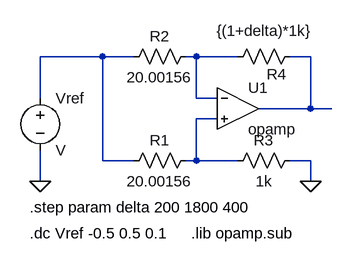
[diagram p0: schematic schema 2.3 Luca Fantin 2000156.asc]
schema 2.3 Luca Fantin 2000156.asc, the LTspice schematic file:
Version 4
SHEET 1 880 680
WIRE 96 0 0 0
WIRE 144 0 96 0
WIRE 240 0 224 0
WIRE 304 0 240 0
WIRE 416 0 384 0
WIRE 0 64 0 0
WIRE 240 64 240 0
WIRE 272 64 240 64
WIRE 416 80 416 0
WIRE 416 80 336 80
WIRE 448 80 416 80
WIRE 272 96 240 96
WIRE 96 160 96 0
WIRE 144 160 96 160
WIRE 240 160 240 96
WIRE 240 160 224 160
WIRE 304 160 240 160
WIRE 416 160 384 160
WIRE 0 192 0 144
WIRE 416 192 416 160
FLAG 416 192 0
FLAG 0 192 0
SYMBOL res 240 -16 R90
WINDOW 0 0 56 VBottom 2
WINDOW 3 32 56 VTop 2
SYMATTR InstName R2
SYMATTR Value 20.00156
SYMBOL OpAmps\\opamp 304 16 R0
SYMATTR InstName U1
SYMBOL res 240 144 R90
WINDOW 0 0 56 VBottom 2
WINDOW 3 32 56 VTop 2
SYMATTR InstName R1
SYMATTR Value 20.00156
SYMBOL res 400 144 R90
WINDOW 0 0 56 VBottom 2
WINDOW 3 32 56 VTop 2
SYMATTR InstName R3
SYMATTR Value 1k
SYMBOL res 400 -16 R90
WINDOW 0 59 36 VBottom 2
WINDOW 3 -39 55 VTop 2
SYMATTR InstName R4
SYMATTR Value {(1+delta)*1k}
SYMBOL voltage 0 48 R0
SYMATTR InstName Vref
TEXT -16 232 Left 2 !.step param delta 200 1800 400
TEXT -16 272 Left 2 !.dc Vref -0.5 0.5 0.1
TEXT 232 272 Left 2 !.lib opamp.sub

The netlist it stands for:
* schema 2.3 Luca Fantin 2000156.asc
R2 N002 N001 20.00156
XU1 N002 N004 N003 opamp Aol=100K GBW=10Meg  ; pins invin noninvin out
R1 N004 N001 20.00156
R3 0 N004 1k
R4 N003 N002 {(1+delta)*1k}
Vref N001 0 V
.step param delta 200 1800 400
.dc Vref -0.5 0.5 0.1
.lib opamp.sub
.backanno
.end